# Altium project BEAR4.PrjPcb (part 1 of 2)
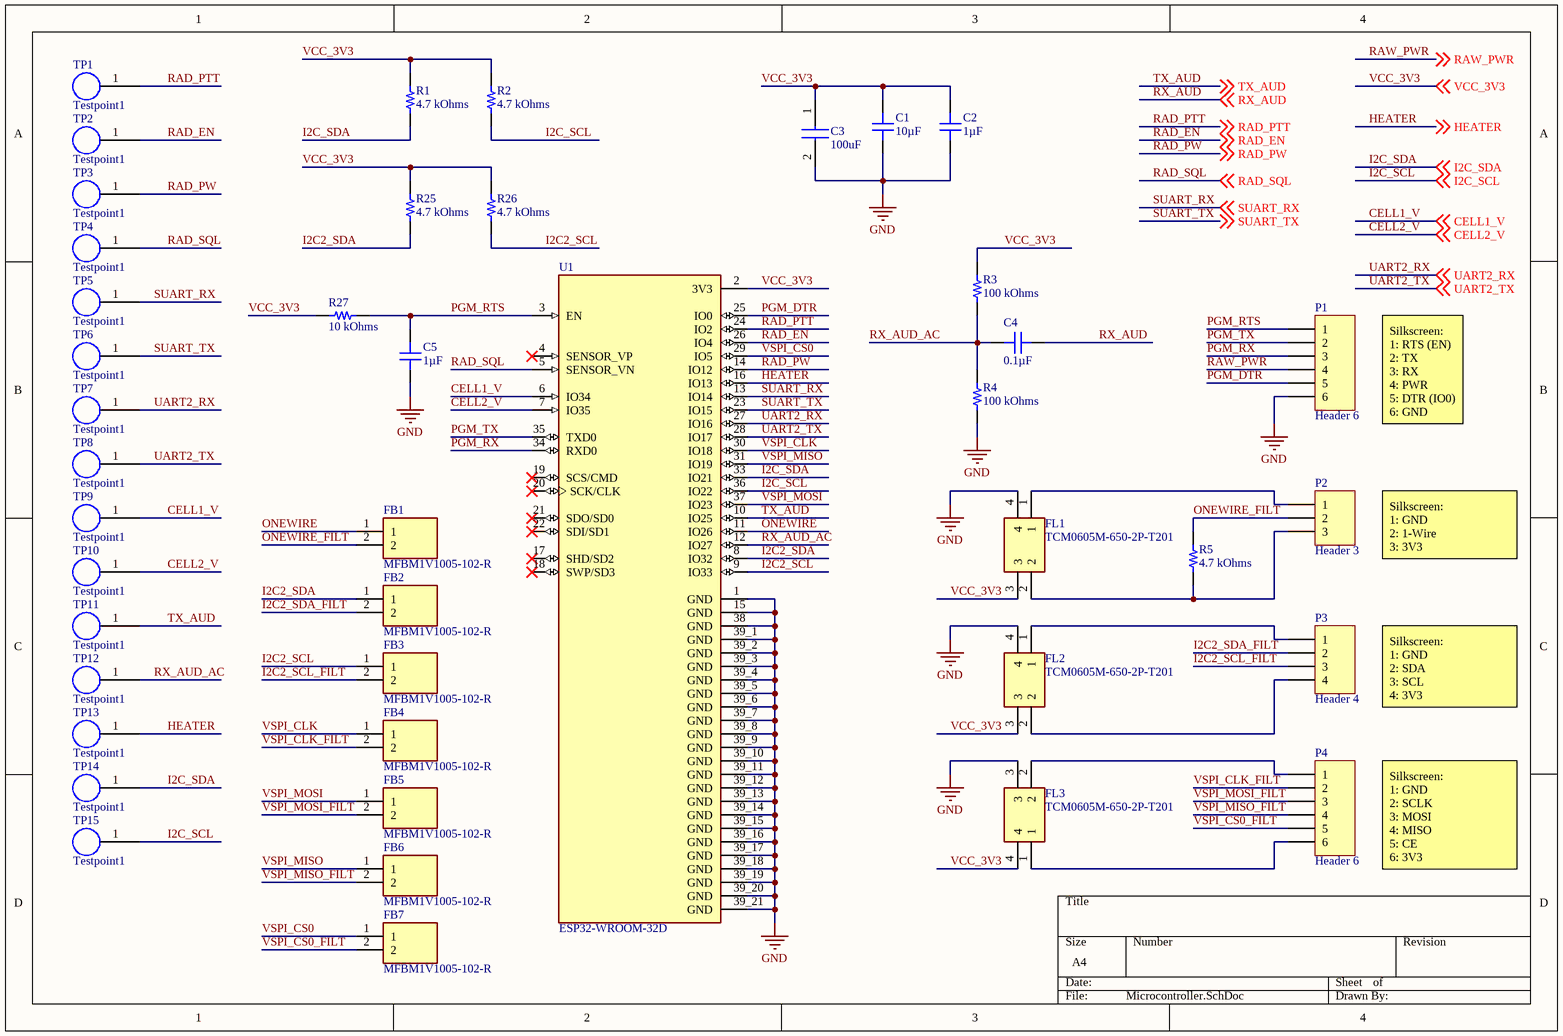
[diagram p0: Microcontroller.SchDoc]
5 sheets, 160 parts. Net scope: global (net labels, ports and power ports of the same name join across sheets).
Board files: BEAR4.PcbDoc, BEAR4_Panel.PcbDoc
Sheets:
  Microcontroller.SchDoc
  Power.SchDoc
  SensorSuite.SchDoc
  Radio.SchDoc
  GPS.SchDoc

## Sheet Microcontroller.SchDoc
size A4; SheetNumber: 1; SheetTotal: 5

### Parts
C1  10µF  [CAP 0402_1005]
C2  1µF  [CAP 0402_1005]
C3  100uF  [CAPC3225X270N]
C4  0.1µF  [CAP 0402_1005]
C5  1µF  [CAP 0402_1005]
FB1  MFBM1V1005-102-R  [BEADC1005X65N]
FB2  MFBM1V1005-102-R  [BEADC1005X65N]
FB3  MFBM1V1005-102-R  [BEADC1005X65N]
FB4  MFBM1V1005-102-R  [BEADC1005X65N]
FB5  MFBM1V1005-102-R  [BEADC1005X65N]
FB6  MFBM1V1005-102-R  [BEADC1005X65N]
FB7  MFBM1V1005-102-R  [BEADC1005X65N]
FL1  TCM0605M-650-2P-T201  [TCM0605M]
FL2  TCM0605M-650-2P-T201  [TCM0605M]
FL3  TCM0605M-650-2P-T201  [TCM0605M]
P1  Header 6  [HDR1X6]
P2  Header 3  [HDR1X3]
P3  Header 4  [HDR1X4]
P4  Header 6  [HDR1X6]
R1  4.7 kOhms  [RES 0402_1005]
R2  4.7 kOhms  [RES 0402_1005]
R3  100 kOhms  [RES 0402_1005]
R4  100 kOhms  [RES 0402_1005]
R5  4.7 kOhms  [RES 0402_1005]
R25  4.7 kOhms  [RES 0402_1005]
R26  4.7 kOhms  [RES 0402_1005]
R27  10 kOhms  [RES 0402_1005]
TP1  Testpoint1  [Testpoint1]  (no BOM)
TP2  Testpoint1  [Testpoint1]  (no BOM)
TP3  Testpoint1  [Testpoint1]  (no BOM)
TP4  Testpoint1  [Testpoint1]  (no BOM)
TP5  Testpoint1  [Testpoint1]  (no BOM)
TP6  Testpoint1  [Testpoint1]  (no BOM)
TP7  Testpoint1  [Testpoint1]  (no BOM)
TP8  Testpoint1  [Testpoint1]  (no BOM)
TP9  Testpoint1  [Testpoint1]  (no BOM)
TP10  Testpoint1  [Testpoint1]  (no BOM)
TP11  Testpoint1  [Testpoint1]  (no BOM)
TP12  Testpoint1  [Testpoint1]  (no BOM)
TP13  Testpoint1  [Testpoint1]  (no BOM)
TP14  Testpoint1  [Testpoint1]  (no BOM)
TP15  Testpoint1  [Testpoint1]  (no BOM)
U1  ESP32-WROOM-32D  [MODULE_ESP32-WROOM-32D]

### Nets
GND: C1.1 C2.1 C3.2 C5.1 FL1.4 FL2.4 FL3.3 P1.6 R4.1 U1.1(GND) U1.15(GND) U1.38(GND) U1.39_1(GND) U1.39_2(GND) U1.39_3(GND) U1.39_4(GND) U1.39_5(GND) U1.39_6(GND) U1.39_7(GND) U1.39_8(GND) U1.39_9(GND) U1.39_10(GND) U1.39_11(GND) U1.39_12(GND) U1.39_13(GND) U1.39_14(GND) U1.39_15(GND) U1.39_16(GND) U1.39_17(GND) U1.39_18(GND) U1.39_19(GND) U1.39_20(GND) U1.39_21(GND)
CELL1_V: TP9.1 U1.6(IO34) ; off-sheet CELL1_V
CELL2_V: TP10.1 U1.7(IO35) ; off-sheet CELL2_V
HEATER: TP13.1 U1.16(IO13) ; off-sheet HEATER
I2C2_SCL: FB3.1 R26.1 U1.9(IO33)
I2C2_SCL_FILT: FB3.2 P3.3
I2C2_SDA: FB2.1 R25.1 U1.8(IO32)
I2C2_SDA_FILT: FB2.2 P3.2
I2C_SCL: R2.1 TP15.1 U1.36(IO22) ; off-sheet I2C_SCL
I2C_SDA: R1.1 TP14.1 U1.33(IO21) ; off-sheet I2C_SDA
ONEWIRE: FB1.1 U1.11(IO26)
ONEWIRE_FILT: FB1.2 P2.2 R5.2
PGM_DTR: P1.5 U1.25(IO0)
PGM_RTS: C5.2 P1.1 R27.2 U1.3(EN)
PGM_RX: P1.3 U1.34(RXD0)
PGM_TX: P1.2 U1.35(TXD0)
RAD_EN: TP2.1 U1.26(IO4) ; off-sheet RAD_EN
RAD_PTT: TP1.1 U1.24(IO2) ; off-sheet RAD_PTT
RAD_PW: TP3.1 U1.14(IO12) ; off-sheet RAD_PW
RAD_SQL: TP4.1 U1.5(SENSOR_VN) ; off-sheet RAD_SQL
RAW_PWR: P1.4 ; off-sheet RAW_PWR
RX_AUD: C4.1 ; off-sheet RX_AUD
RX_AUD_AC: C4.2 R3.1 R4.2 TP12.1 U1.12(IO27)
SUART_RX: TP5.1 U1.13(IO14) ; off-sheet SUART_RX
SUART_TX: TP6.1 U1.23(IO15) ; off-sheet SUART_TX
TX_AUD: TP11.1 U1.10(IO25) ; off-sheet TX_AUD
UART2_RX: TP7.1 U1.27(IO16) ; off-sheet UART2_RX
UART2_TX: TP8.1 U1.28(IO17) ; off-sheet UART2_TX
VCC_3V3: C1.2 C2.2 C3.1 FL1.3 FL2.3 FL3.4 R1.2 R2.2 R3.2 R25.2 R26.2 R27.1 U1.2(3V3) ; off-sheet VCC_3V3
VSPI_CLK: FB4.1 U1.30(IO18)
VSPI_CLK_FILT: FB4.2 P4.2
VSPI_CS0: FB7.1 U1.29(IO5)
VSPI_CS0_FILT: FB7.2 P4.5
VSPI_MISO: FB6.1 U1.31(IO19)
VSPI_MISO_FILT: FB6.2 P4.4
VSPI_MOSI: FB5.1 U1.37(IO23)
VSPI_MOSI_FILT: FB5.2 P4.3
NetFL1_1: FL1.1 P2.1
NetFL1_2: FL1.2 P2.3 R5.1
NetFL2_1: FL2.1 P3.1
NetFL2_2: FL2.2 P3.4
NetFL3_1: FL3.1 P4.6
NetFL3_2: FL3.2 P4.1

Not connected (* = marked no-connect by the designer): U1 4(SENSOR_VP)* 17(SHD/SD2)* 18(SWP/SD3)* 19(SCS/CMD)* 20(SCK/CLK)* 21(SDO/SD0)* 22(SDI/SD1)*

### Notes on the sheet
- Silkscreen:
  1: RTS (EN)
  2: TX
  3: RX
  4: PWR
  5: DTR (IO0)
  6: GND
- Silkscreen:
  1: GND
  2: 1-Wire
  3: 3V3
- Silkscreen:
  1: GND
  2: SDA
  3: SCL
  4: 3V3
- Silkscreen:
  1: GND
  2: SCLK
  3: MOSI
  4: MISO
  5: CE
  6: 3V3

### Library data of the parts
C1 = C0402C106M9PAC7867: CAP CER 10UF 6.3V X5R 0402; Manufacturer: KEMET; Tolerance: ±20%; Part Number: C0402C106M9PAC7867; Value: 10µF; Applications: General Purpose; Capacitance: 10µF; ComponentLink1Description: Datasheet; ComponentLink1URL: https://api.kemet.com/component-edge/download/datasheet/C0402C106M9PAC7867.pdf; ComponentLink2Description: DigiKey Link; ComponentLink2URL: http://digikey.com/product-detail/en/kemet/C0402C106M9PAC7867/399-13069-1-ND/5767556; Device Package: 0402 (1005 Metric); LastUpdated: 2/9/2020 1:02:21 AM; Lifecycle Status: Active; Minimum Order: 1; Mounting Type: Surface Mount, MLCC; Operating Temperature: -55°C ~ 85°C; Package / Case: 0402 (1005 Metric); Packaging: TapeAndReel; PartId: 3087; Part Status: Active; Price: 0.13; Series: SMD Comm X5R; Size / Dimension: 0.039" L x 0.020" W (1.00mm x 0.50mm); Supplier 1: DigiKey; Supplier Part Number 1: 399-13069-1-ND; Temperature Coefficient: X5R; Thickness (Max): 0.028" (0.70mm); Voltage - Rated: 6.3V
C2 C5 = 0402YD105KAT2A: CAP CER 1UF 16V X5R 0402; Manufacturer: AVX Corporation; Tolerance: ±10%; Part Number: 0402YD105KAT2A; Value: 1µF; Applications: General Purpose; Capacitance: 1µF; ComponentLink1Description: Datasheet; ComponentLink1URL: http://datasheets.avx.com/cx5r.pdf; ComponentLink2Description: DigiKey Link; ComponentLink2URL: http://digikey.com/product-detail/en/avx-corporation/0402YD105KAT2A/478-10179-1-ND/6797606; Device Package: 0402 (1005 Metric); LastUpdated: 2/9/2020 1:02:22 AM; Lifecycle Status: Active; Minimum Order: 1; Mounting Type: Surface Mount, MLCC; Operating Temperature: -55°C ~ 85°C; Package / Case: 0402 (1005 Metric); Packaging: TapeAndReel; PartId: 2859; Part Status: Active; Price: 0.07; Series: -; Size / Dimension: 0.039" L x 0.020" W (1.00mm x 0.50mm); Supplier 1: DigiKey; Supplier Part Number 1: 478-10179-1-ND; Temperature Coefficient: X5R; Thickness (Max): 0.022" (0.55mm); Voltage - Rated: 16V
C3 = GRM32EC70J107ME15L: Capacitor; Manufacturer_Name: Murata Electronics; Datasheet Link: https://componentsearchengine.com//GRM32EC70J107ME15L.pdf; Height: 2.7mm; Mouser2 Part Number: 81-GRM32EC70J107ME5L; Mouser2 Price/Stock: https://www.mouser.com/Search/Refine.aspx?Keyword=81-GRM32EC70J107ME5L; Manufacturer_Part_Number: GRM32EC70J107ME15L
C4 = C0402C104K9PACTU: CAP CER 0.1UF 6.3V X5R 0402; Manufacturer: KEMET; Tolerance: ±10%; Part Number: C0402C104K9PACTU; Value: 0.1µF; Applications: General Purpose; Capacitance: 0.1µF; ComponentLink1Description: Datasheet; ComponentLink1URL: https://api.kemet.com/component-edge/download/datasheet/C0402C104K9PACTU.pdf; ComponentLink2Description: DigiKey Link; ComponentLink2URL: http://digikey.com/product-detail/en/kemet/C0402C104K9PACTU/399-3026-1-ND/447602; Device Package: 0402 (1005 Metric); LastUpdated: 2/9/2020 1:01:34 AM; Lifecycle Status: Active; Minimum Order: 1; Mounting Type: Surface Mount, MLCC; Operating Temperature: -55°C ~ 85°C; Package / Case: 0402 (1005 Metric); Packaging: TapeAndReel; PartId: 12742; Part Status: Active; Price: 0.01; Series: SMD Comm X5R; Size / Dimension: 0.039" L x 0.020" W (1.00mm x 0.50mm); Supplier 1: DigiKey; Supplier Part Number 1: 399-3026-1-ND; Temperature Coefficient: X5R; Thickness (Max): 0.022" (0.55mm); Voltage - Rated: 6.3V
FB1-FB7 = MFBM1V1005-102-R: Ferrite Bead; Manufacturer_Name: Eaton; Manufacturer_Part_Number: MFBM1V1005-101-R; Assembly Instruction: DNP; Datasheet Link: https://www.mouser.in/datasheet/2/87/eaton_mfbm1v1005_high_current_multilayer_ferrite_c-1890673.pdf; Height: 0.65mm
FL1-FL3 = TCM0605M-650-2P-T201: Filter; Manufacturer_Name: TDK; Assembly Instruction: DNP; Datasheet Link: https://product.tdk.com/system/files/dam/doc/product/emc/emc/cmf_cmc/catalog/cmf_commercial_signal_tcm0605m_en.pdf; Height: 0.35mm; Manufacturer_Part_Number: TCM0605M-650-2P-T201
P1 P4 = Header 6: Header, 6-Pin; LatestRevisionDate: 17-Jul-2002; LatestRevisionNote: Re-released for DXP Platform.; Publisher: Altium Limited
P2 = Header 3: Header, 3-Pin; LatestRevisionDate: 17-Jul-2002; LatestRevisionNote: Re-released for DXP Platform.; Publisher: Altium Limited
P3 = Header 4: Header, 4-Pin; LatestRevisionDate: 17-Jul-2002; LatestRevisionNote: Re-released for DXP Platform.; Publisher: Altium Limited
R1 R2 R25 R26 = CRCW04024K70JNEDC: RES SMD 4.7K OHM 5% 1/16W 0402; Manufacturer: Vishay Dale; Power (Watts): 0.063W, 1/16W; Temperature Coefficient: ±200ppm/°C; Part Number: CRCW04024K70JNEDC; Value: 4.7 kOhms; ComponentLink1Description: Datasheet; ComponentLink1URL: http://www.vishay.com/docs/28773/crcwce3.pdf; ComponentLink2Description: DigiKey Link; ComponentLink2URL: http://digikey.com/product-detail/en/vishay-dale/CRCW04024K70JNEDC/541-3974-1-ND/7928657; Composition: Thick Film; Device Package: 0402 (1005 Metric); Height - Seated (Max): 0.014" (0.35mm); LastUpdated: 2/9/2020 1:07:41 AM; Lifecycle Status: Active; Minimum Order: 1; Number of Terminations: 2; Operating Temperature: -55°C ~ 155°C; Package / Case: 0402 (1005 Metric); Packaging: CutTape; PartId: 15960; Part Status: Active; Price: 0.10; Resistance: 4.7 kOhms; Series: CRCW-C; Size / Dimension: 0.039" L x 0.020" W (1.00mm x 0.50mm); Supplier 1: DigiKey; Supplier Part Number 1: 541-3974-1-ND; Supplier Device Package: 0402; Tolerance: ±5%
R3 R4 = AC0402FR-07100KL: RES SMD 100K OHM 1% 1/16W 0402; Manufacturer: Yageo; Power (Watts): 0.063W, 1/16W; Temperature Coefficient: ±100ppm/°C; Part Number: AC0402FR-07100KL; Value: 100 kOhms; ComponentLink1Description: Datasheet; ComponentLink1URL: https://www.yageo.com/upload/media/product/productsearch/datasheet/rchip/PYu-AC_51_RoHS_L_7.pdf; ComponentLink2Description: DigiKey Link; ComponentLink2URL: http://digikey.com/product-detail/en/yageo/AC0402FR-07100KL/YAG3434CT-ND/6006283; Composition: Thick Film; Device Package: 0402 (1005 Metric); Features: Automotive AEC-Q200, Moisture Resistant; Height - Seated (Max): 0.015" (0.37mm); LastUpdated: 2/9/2020 1:07:50 AM; Lifecycle Status: Active; Minimum Order: 1; Number of Terminations: 2; Operating Temperature: -55°C ~ 155°C; Package / Case: 0402 (1005 Metric); Packaging: CutTape; PartId: 12047; Part Status: Active; Price: 0.10; Ratings: AEC-Q200; Resistance: 100 kOhms; Series: AC; Size / Dimension: 0.039" L x 0.020" W (1.00mm x 0.50mm); Supplier 1: DigiKey; Supplier Part Number 1: YAG3434CT-ND; Supplier Device Package: 0402; Tolerance: ±1%
R5 = CRCW04024K70JNEDC: RES SMD 4.7K OHM 5% 1/16W 0402; Manufacturer: Vishay Dale; Power (Watts): 0.063W, 1/16W; Temperature Coefficient: ±200ppm/°C; Assembly Instruction: DNP; Part Number: CRCW04024K70JNEDC; Value: 4.7 kOhms; ComponentLink1Description: Datasheet; ComponentLink1URL: http://www.vishay.com/docs/28773/crcwce3.pdf; ComponentLink2Description: DigiKey Link; ComponentLink2URL: http://digikey.com/product-detail/en/vishay-dale/CRCW04024K70JNEDC/541-3974-1-ND/7928657; Composition: Thick Film; Device Package: 0402 (1005 Metric); Height - Seated (Max): 0.014" (0.35mm); LastUpdated: 2/9/2020 1:07:41 AM; Lifecycle Status: Active; Minimum Order: 1; Number of Terminations: 2; Operating Temperature: -55°C ~ 155°C; Package / Case: 0402 (1005 Metric); Packaging: CutTape; PartId: 15960; Part Status: Active; Price: 0.10; Resistance: 4.7 kOhms; Series: CRCW-C; Size / Dimension: 0.039" L x 0.020" W (1.00mm x 0.50mm); Supplier 1: DigiKey; Supplier Part Number 1: 541-3974-1-ND; Supplier Device Package: 0402; Tolerance: ±5%
R27 = CPF0402B10KE1: RES SMD 10K OHM 0.1% 1/16W 0402; Manufacturer: TE Connectivity Passive Product; Power (Watts): 0.063W, 1/16W; Temperature Coefficient: ±25ppm/°C; Part Number: CPF0402B10KE1; Value: 10 kOhms; ComponentLink1Description: Datasheet; ComponentLink1URL: https://www.te.com/commerce/DocumentDelivery/DDEController?Action=srchrtrv&DocNm=1773200&DocType=DS&DocLang=English; ComponentLink2Description: DigiKey Link; ComponentLink2URL: http://digikey.com/product-detail/en/te-connectivity-passive-product/CPF0402B10KE1/A102579CT-ND/2729112; Composition: Thin Film; Device Package: 0402 (1005 Metric); Height - Seated (Max): 0.014" (0.35mm); LastUpdated: 2/9/2020 1:07:41 AM; Lifecycle Status: Active; Minimum Order: 1; Number of Terminations: 2; Operating Temperature: -55°C ~ 155°C; Package / Case: 0402 (1005 Metric); Packaging: TapeAndReel; PartId: 15889; Part Status: Active; Price: 0.13; Resistance: 10 kOhms; Series: CPF, Neohm; Size / Dimension: 0.039" L x 0.020" W (1.00mm x 0.50mm); Supplier 1: DigiKey; Supplier Part Number 1: A102579CT-ND; Supplier Device Package: 0402; Tolerance: ±0.1%
U1 = ESP32-WROOM-32D: Bluetooth, WiFi 802.11b/g/n, Bluetooth v4.2 + EDR, Class 1, 2 and 3 Transceiver Module 2.4GHz ~ 2.5GHz Integrated, Trace Surface Mount; MF: Espressif Systems; Price: None; Package: Module Espressif Systems; Availability: Unavailable; SnapEDA_Link: https://www.snapeda.com/parts/ESP32-WROOM-32D/Espressif%20Systems/view-part/2768115/?ref=snap; Value: *; MP: ESP32-WROOM-32D

## Sheet Power.SchDoc
size A4; SheetNumber: 2; SheetTotal: 5
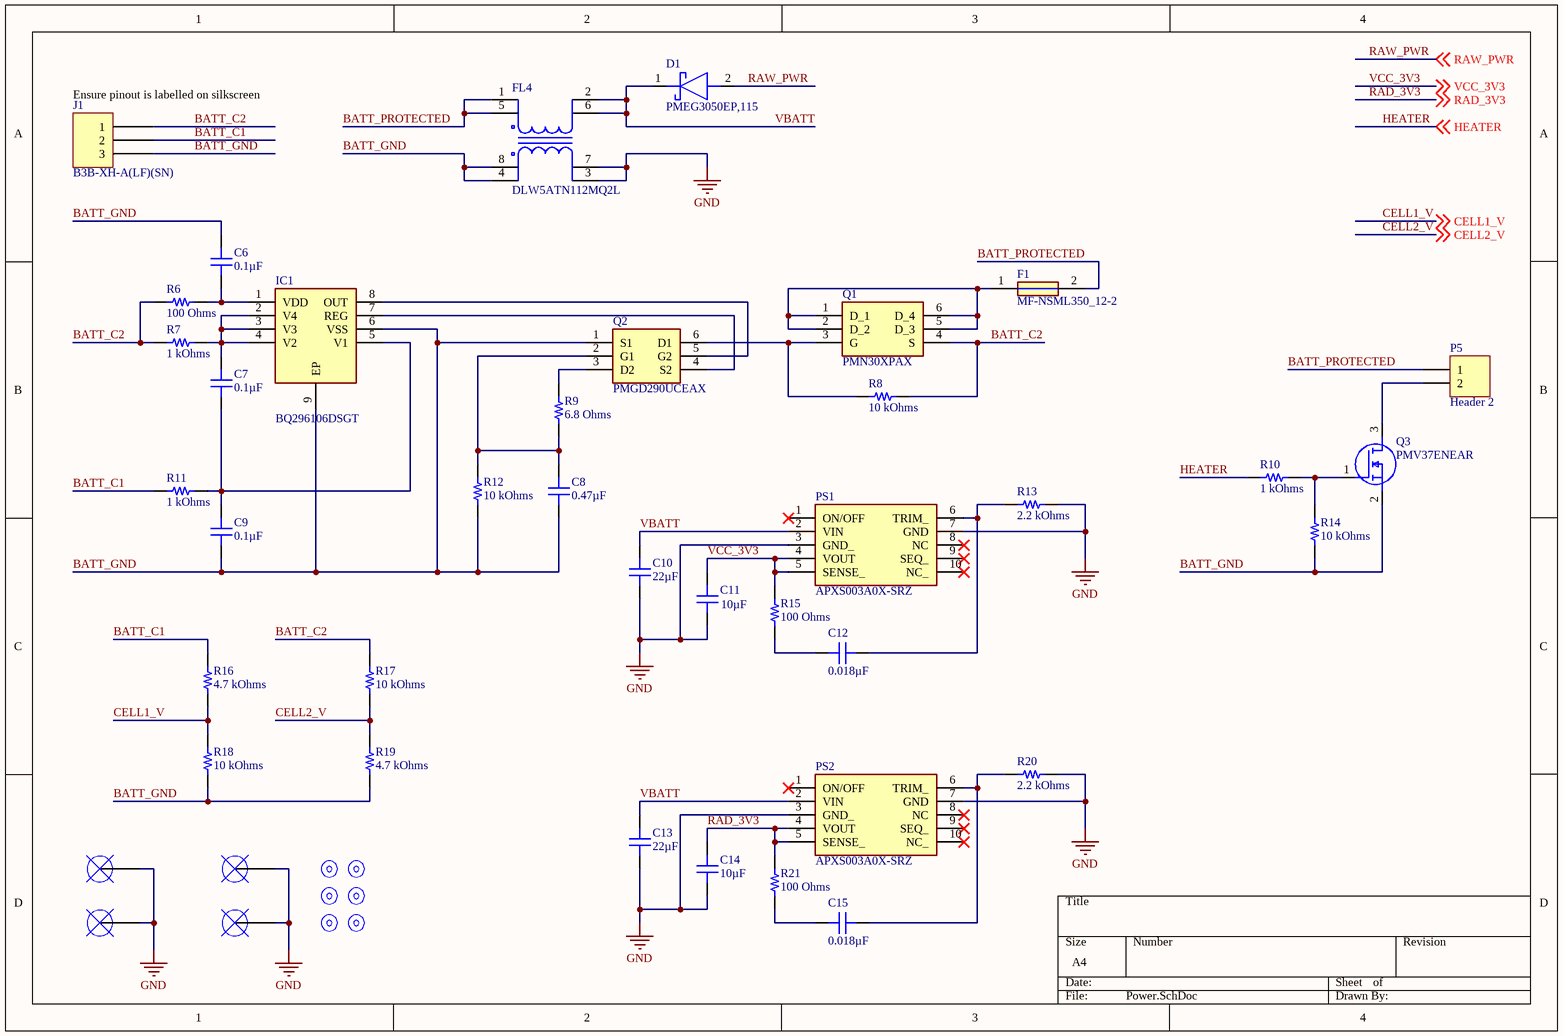
[diagram p1: Power.SchDoc]

### Parts
C6  0.1µF  [CAP 0402_1005]
C7  0.1µF  [CAP 0402_1005]
C8  0.47µF  [CAP 0402_1005]
C9  0.1µF  [CAP 0402_1005]
C10  22µF  [CAP 0805_2012]
C11  10µF  [CAP 0402_1005]
C12  0.018µF  [CAP 0402_1005]
C13  22µF  [CAP 0805_2012]
C14  10µF  [CAP 0402_1005]
C15  0.018µF  [CAP 0402_1005]
D1  PMEG3050EP,115  [PMEG3050EP115]
F1  MF-NSML350_12-2  [FUSC3216X140N]
FL4  DLW5ATN112MQ2L  [DLW5BSN302SQ2L]
FM1  1mm  [FIDUCIAL_MARK_ROUND]  (value not drawn)  (no BOM)
FM2  1mm  [FIDUCIAL_MARK_ROUND]  (value not drawn)  (no BOM)
FM3  1mm  [FIDUCIAL_MARK_ROUND]  (value not drawn)  (no BOM)
FM4  1mm  [FIDUCIAL_MARK_ROUND]  (value not drawn)  (no BOM)
FM5  1mm  [FIDUCIAL_MARK_ROUND]  (value not drawn)  (no BOM)
FM6  1mm  [FIDUCIAL_MARK_ROUND]  (value not drawn)  (no BOM)
IC1  BQ296106DSGT  [SON50P200X200X80-9N]
J1  B3B-XH-A(LF)(SN)  [JST XH B3B-XH-A]
MH1  2.7mm  [Mounting_Hole_Plated_2.7mm-COVERED]  (value not drawn)  (no BOM)
MH2  2.7mm  [Mounting_Hole_Plated_2.7mm-COVERED]  (value not drawn)  (no BOM)
MH3  2.7mm  [Mounting_Hole_Plated_2.7mm-COVERED]  (value not drawn)  (no BOM)
MH4  2.7mm  [Mounting_Hole_Plated_2.7mm-COVERED]  (value not drawn)  (no BOM)
P5  Header 2  [HDR1X2]
PS1  APXS003A0X-SRZ  [APTH003A0XSRZ]
PS2  APXS003A0X-SRZ  [APTH003A0XSRZ]
Q1  PMN30XPAX  [SOT95P275X110-6N]
Q2  PMGD290UCEAX  [SOT65P210X110-6N]
Q3  PMV37ENEAR  [SOT95P230X110-3N]
R6  100 Ohms  [RES 0402_1005]
R7  1 kOhms  [RES 0402_1005]
R8  10 kOhms  [RES 0402_1005]
R9  6.8 Ohms  [RES 0402_1005]
R10  1 kOhms  [RES 0402_1005]
R11  1 kOhms  [RES 0402_1005]
R12  10 kOhms  [RES 0402_1005]
R13  2.2 kOhms  [RES 0402_1005]
R14  10 kOhms  [RES 0402_1005]
R15  100 Ohms  [RES 0402_1005]
R16  4.7 kOhms  [RES 0402_1005]
R17  10 kOhms  [RES 0402_1005]
R18  10 kOhms  [RES 0402_1005]
R19  4.7 kOhms  [RES 0402_1005]
R20  2.2 kOhms  [RES 0402_1005]
R21  100 Ohms  [RES 0402_1005]

### Nets
GND: C10.1 C11.1 C13.1 C14.1 FL4.3 FL4.7 MH1.0 MH2.0 MH3.0 MH4.0 PS1.3(GND_) PS1.7(GND) PS2.3(GND_) PS2.7(GND) R13.1 R20.2
BATT_C1: J1.2 R11.1 R16.2
BATT_C2: J1.1 Q1.4(S) R6.2 R7.1 R8.1 R17.1
BATT_GND: C6.2 C8.1 C9.1 FL4.4 FL4.8 IC1.6(VSS) IC1.9(EP) J1.3 Q2.1(S1) Q3.2(S) R12.2 R14.2 R18.2 R19.1
BATT_PROTECTED: F1.2 FL4.1 FL4.5 P5.1
CELL1_V: R16.1 R18.1 ; off-sheet CELL1_V
CELL2_V: R17.2 R19.2 ; off-sheet CELL2_V
HEATER: R10.1 ; off-sheet HEATER
RAD_3V3: C14.2 PS2.4(VOUT) PS2.5(SENSE_) R21.1 ; off-sheet RAD_3V3
RAW_PWR: D1.2(A) ; off-sheet RAW_PWR
VBATT: C10.2 C13.2 D1.1(K) FL4.2 FL4.6 PS1.2(VIN) PS2.2(VIN)
VCC_3V3: C11.2 PS1.4(VOUT) PS1.5(SENSE_) R15.1 ; off-sheet VCC_3V3
NetC6_1: C6.1 IC1.1(VDD) R6.1
NetC7_1: C7.1 C9.2 IC1.5(V1) R11.2
NetC7_2: C7.2 IC1.2(V4) IC1.3(V3) IC1.4(V2) R7.2
NetC8_2: C8.2 Q2.2(G1) R9.1 R12.1
NetC12_1: C12.1 R15.2
NetC12_2: C12.2 PS1.6(TRIM_) R13.2
NetC15_1: C15.1 R21.2
NetC15_2: C15.2 PS2.6(TRIM_) R20.1
NetF1_1: F1.1 Q1.1(D_1) Q1.2(D_2) Q1.5(D_3) Q1.6(D_4)
NetIC1_7: IC1.7(REG) Q2.4(S2)
NetIC1_8: IC1.8(OUT) Q2.5(G2)
NetP5_2: P5.2 Q3.3(D)
NetQ1_3: Q1.3(G) Q2.6(D1) R8.2
NetQ2_3: Q2.3(D2) R9.2
NetQ3_1: Q3.1(G) R10.2 R14.1

Not connected (* = marked no-connect by the designer): FM1 FD0; FM2 FD0; FM3 FD0; FM4 FD0; FM5 FD0; FM6 FD0; PS1 1(ON/OFF)* 8(NC)* 9(SEQ_)* 10(NC_)*; PS2 1(ON/OFF)* 8(NC)* 9(SEQ_)* 10(NC_)*

### Notes on the sheet
- (near J1) Ensure pinout is labelled on silkscreen

### Library data of the parts
C6 C7 C9 = C0402C104K9PACTU: as C4 on sheet Microcontroller; Part Number: C0402C104K9PACTU; Value: 0.1µF; Applications: General Purpose; Capacitance: 0.1µF; ComponentLink1Description: Datasheet; ComponentLink1URL: https://api.kemet.com/component-edge/download/datasheet/C0402C104K9PACTU.pdf; ComponentLink2Description: DigiKey Link; ComponentLink2URL: http://digikey.com/product-detail/en/kemet/C0402C104K9PACTU/399-3026-1-ND/447602; Device Package: 0402 (1005 Metric); LastUpdated: 2/9/2020 1:01:34 AM; Lifecycle Status: Active; Minimum Order: 1; Mounting Type: Surface Mount, MLCC; Operating Temperature: -55°C ~ 85°C; Package / Case: 0402 (1005 Metric); Packaging: TapeAndReel; PartId: 12742; Part Status: Active; Price: 0.01; Series: SMD Comm X5R; Size / Dimension: 0.039" L x 0.020" W (1.00mm x 0.50mm); Supplier 1: DigiKey; Supplier Part Number 1: 399-3026-1-ND; Temperature Coefficient: X5R; Thickness (Max): 0.022" (0.55mm); Voltage - Rated: 6.3V
C8 = C1005X5R1E474K050BE: CAP CER 0.47UF 25V X5R 0402; Manufacturer: TDK Corporation; Tolerance: ±10%; Part Number: C1005X5R1E474K050BE; Value: 0.47µF; Applications: Boardflex Sensitive; Capacitance: 0.47µF; ComponentLink1Description: Datasheet; ComponentLink1URL: https://product.tdk.com/info/en/catalog/datasheets/mlcc_commercial_soft_en.pdf?ref_disty=digikey; ComponentLink2Description: DigiKey Link; ComponentLink2URL: http://digikey.com/product-detail/en/tdk-corporation/C1005X5R1E474K050BE/445-175217-1-ND/7907781; Device Package: 0402 (1005 Metric); Features: Soft Termination; LastUpdated: 2/9/2020 1:01:22 AM; Lifecycle Status: Active; Minimum Order: 1; Mounting Type: Surface Mount, MLCC; Operating Temperature: -55°C ~ 85°C; Package / Case: 0402 (1005 Metric); Packaging: TapeAndReel; PartId: 13175; Part Status: Active; Price: 0.02; Series: C; Size / Dimension: 0.039" L x 0.020" W (1.00mm x 0.50mm); Supplier 1: DigiKey; Supplier Part Number 1: 445-175217-1-ND; Temperature Coefficient: X5R; Thickness (Max): 0.024" (0.60mm); Voltage - Rated: 25V
C10 C13 = C2012X6S1C226M125AC: CAP CER 22UF 16V X6S 0805; Manufacturer: TDK Corporation; Tolerance: ±20%; Part Number: C2012X6S1C226M125AC; Value: 22µF; Applications: General Purpose; Capacitance: 22µF; ComponentLink1Description: Datasheet; ComponentLink1URL: https://product.tdk.com/info/en/catalog/datasheets/mlcc_commercial_general_en.pdf?ref_disty=digikey; ComponentLink2Description: DigiKey Link; ComponentLink2URL: http://digikey.com/product-detail/en/tdk-corporation/C2012X6S1C226M125AC/445-14486-1-ND/3956152; Device Package: 0805 (2012 Metric); Features: Low ESL; LastUpdated: 2/9/2020 1:04:25 AM; Lifecycle Status: Active; Minimum Order: 1; Mounting Type: Surface Mount, MLCC; Operating Temperature: -55°C ~ 105°C; Package / Case: 0805 (2012 Metric); Packaging: TapeAndReel; PartId: 11672; Part Status: Active; Price: 0.19; Series: C; Size / Dimension: 0.079" L x 0.049" W (2.00mm x 1.25mm); Supplier 1: DigiKey; Supplier Part Number 1: 445-14486-1-ND; Temperature Coefficient: X6S; Thickness (Max): 0.057" (1.45mm); Voltage - Rated: 16V
C11 C14 = C0402C106M9PAC7867: as C1 on sheet Microcontroller; Part Number: C0402C106M9PAC7867; Value: 10µF; Applications: General Purpose; Capacitance: 10µF; ComponentLink1Description: Datasheet; ComponentLink1URL: https://api.kemet.com/component-edge/download/datasheet/C0402C106M9PAC7867.pdf; ComponentLink2Description: DigiKey Link; ComponentLink2URL: http://digikey.com/product-detail/en/kemet/C0402C106M9PAC7867/399-13069-1-ND/5767556; Device Package: 0402 (1005 Metric); LastUpdated: 2/9/2020 1:02:21 AM; Lifecycle Status: Active; Minimum Order: 1; Mounting Type: Surface Mount, MLCC; Operating Temperature: -55°C ~ 85°C; Package / Case: 0402 (1005 Metric); Packaging: TapeAndReel; PartId: 3087; Part Status: Active; Price: 0.13; Series: SMD Comm X5R; Size / Dimension: 0.039" L x 0.020" W (1.00mm x 0.50mm); Supplier 1: DigiKey; Supplier Part Number 1: 399-13069-1-ND; Temperature Coefficient: X5R; Thickness (Max): 0.028" (0.70mm); Voltage - Rated: 6.3V
C12 C15 = CC0402KRX7R8BB183: CAP CER 0.018UF 25V X7R 0402; Manufacturer: Yageo; Tolerance: ±10%; Part Number: CC0402KRX7R8BB183; Value: 0.018µF; Applications: General Purpose; Capacitance: 0.018µF; ComponentLink1Description: Datasheet; ComponentLink1URL: https://www.yageo.com/upload/media/product/productsearch/datasheet/mlcc/UPY-GPHC_X7R_6.3V-to-50V_18.pdf; ComponentLink2Description: DigiKey Link; ComponentLink2URL: http://digikey.com/product-detail/en/yageo/CC0402KRX7R8BB183/311-3345-1-ND/6818315; Device Package: 0402 (1005 Metric); LastUpdated: 2/9/2020 1:02:03 AM; Lifecycle Status: Active; Minimum Order: 1; Mounting Type: Surface Mount, MLCC; Operating Temperature: -55°C ~ 125°C; Package / Case: 0402 (1005 Metric); Packaging: TapeAndReel; PartId: 11317; Part Status: Active; Price: 0.01; Series: CC; Size / Dimension: 0.039" L x 0.020" W (1.00mm x 0.50mm); Supplier 1: DigiKey; Supplier Part Number 1: 311-3345-1-ND; Temperature Coefficient: X7R; Thickness (Max): 0.022" (0.55mm); Voltage - Rated: 25V
D1 = PMEG3050EP,115: Schottky Diode; Manufacturer_Name: Nexperia; Datasheet Link: https://datasheet.datasheetarchive.com/originals/distributors/Datasheets_SAMA/fa882cf4aa6eed6383790f96e9182165.pdf; Height: 1mm; Manufacturer_Part_Number: PMEG3050EP,115
F1 = MF-NSML350_12-2: Fuse; Manufacturer_Name: Bourns; Manufacturer_Part_Number: MF-NSML350/12-2; Datasheet Link: https://componentsearchengine.com/Datasheets/1/MF-NSML350_12-2.pdf; Height: 1.4mm
FL4 = DLW5ATN112MQ2L: Filter; Manufacturer_Name: Murata Electronics; Datasheet Link: https://componentsearchengine.com//DLW5ATN112MQ2L.pdf; Height: 2.35mm; Mouser2 Part Number: 81-DLW5ATN112MQ2L; Mouser2 Price/Stock: https://www.mouser.com/Search/Refine.aspx?Keyword=81-DLW5ATN112MQ2L; Manufacturer_Part_Number: DLW5ATN112MQ2L
FM1-FM6 = Fiducial_Mark: Fiducial mark, width 1mm, clearance 3mm; Width: 1 mm; Clearance: 3 mm
IC1 = BQ296106DSGT: Integrated Circuit; Manufacturer_Name: Texas Instruments; Datasheet Link: https://www.ti.com/lit/ds/symlink/bq2961.pdf?ts=1629467003310&ref_url=https%253A%252F%252Fwww.ti.com%252Fstore%252Fti%252Fen%252Fp%252Fproduct%252F%253Fp%253DBQ296106DSGT; Height: 0.8mm; Manufacturer_Part_Number: BQ296106DSGT
J1 = B3B-XH-A(LF)(SN): CONN HEADER VERT 3POS 2.5MM; Manufacturer: JST Sales America Inc.; Contact Length - Post: 0.134" (3.40mm); Current Rating (Amps): 3A; Material Flammability Rating: UL94 V-0; Number of Positions: 3; Number of Positions Loaded: All; Pitch - Mating: 0.098" (2.50mm); Shrouding: Shrouded - 4 Wall; Style: Board to Cable/Wire; Voltage Rating: 250V; Part Number: B3B-XH-A(LF)(SN); ComponentLink1Description: Datasheet; ComponentLink1URL: http://www.jst-mfg.com/product/pdf/eng/eXH.pdf; ComponentLink2Description: DigiKey Link; ComponentLink2URL: http://digikey.com/product-detail/en/jst-sales-america-inc/B3B-XH-A-LF-SN/455-2248-ND/1651046; Connector Type: Header; Contact Finish - Mating: Tin; Contact Finish - Post: Tin; Contact Material: Brass; Contact Shape: Square; Contact Type: Male Pin; Fastening Type: Detent Lock; Insulation Color: Natural; Insulation Height: 0.276" (7.00mm); Insulation Material: Polyamide (PA66), Nylon 6/6; LastUpdated: 12/1/2020 11:46:22 PM; Lifecycle Status: Active; Minimum Order: 1; Mounting Type: Through Hole; Number of Rows: 1; Operating Temperature: -25°C ~ 85°C; Packaging: Bulk; PartId: 68; Part Status: Active; Price: 0.19; Series: XH; Supplier 1: DigiKey; Supplier Part Number 1: 455-2248-ND; Termination: Press-Fit, Solder
MH1-MH4 = Mounting_Hole_2.7mm: Mounting hole, hole size 2.7mm; Hole radius: 2.7 mm; Diameter (plated): *; Keep out (radius): *; Plated: *
P5 = Header 2: Header, 2-Pin; LatestRevisionDate: 17-Jul-2002; LatestRevisionNote: Re-released for DXP Platform.; Publisher: Altium Limited
PS1 PS2 = APXS003A0X-SRZ: Power Supply; Manufacturer_Name: ABB; Datasheet Link: https://www.mouser.sg/datasheet/2/167/APTS003A0X-1920083.pdf; Height: 6.25mm; Manufacturer_Part_Number: APXS003A0X-SRZ
Q1 = PMN30XPAX: MOSFET (P-Channel); Manufacturer_Name: Nexperia; Datasheet Link: https://www.mouser.in/datasheet/2/916/PMN30XPA-1839888.pdf; Height: 1.1mm; Manufacturer_Part_Number: PMN30XPAX
Q2 = PMGD290UCEAX: Transistor; Manufacturer_Name: Nexperia; Datasheet Link: https://ms.componentsearchengine.com/Datasheets/2/PMGD290UCEAX.pdf; Height: 1.1mm; Manufacturer_Part_Number: PMGD290UCEAX
Q3 = PMV37ENEAR: MOSFET (N-Channel); Manufacturer_Name: Nexperia; Datasheet Link: https://componentsearchengine.com/Datasheets/2/PMV37ENEAR.pdf; Height: 1.1mm; Manufacturer_Part_Number: PMV37ENEAR
R6 R15 R21 = CRG0402F100R: RES SMD 100 OHM 1% 1/16W 0402; Manufacturer: TE Connectivity Passive Product; Power (Watts): 0.063W, 1/16W; Temperature Coefficient: ±100ppm/°C; Part Number: CRG0402F100R; Value: 100 Ohms; ComponentLink1Description: Datasheet; ComponentLink1URL: https://www.te.com/commerce/DocumentDelivery/DDEController?Action=srchrtrv&DocNm=1773204&DocType=DS&DocLang=English; ComponentLink2Description: DigiKey Link; ComponentLink2URL: http://digikey.com/product-detail/en/te-connectivity-passive-product/CRG0402F100R/A121527CT-ND/5246516; Composition: Thick Film; Device Package: 0402 (1005 Metric); Height - Seated (Max): 0.016" (0.40mm); LastUpdated: 2/9/2020 1:07:28 AM; Lifecycle Status: Active; Minimum Order: 1; Number of Terminations: 2; Operating Temperature: -55°C ~ 155°C; Package / Case: 0402 (1005 Metric); Packaging: CutTape; PartId: 20718; Part Status: Active; Price: 0.10; Resistance: 100 Ohms; Series: CRG, Neohm; Size / Dimension: 0.039" L x 0.020" W (1.00mm x 0.50mm); Supplier 1: DigiKey; Supplier Part Number 1: A121527CT-ND; Supplier Device Package: 0402; Tolerance: ±1%
R7 R10 R11 = CRCW04021K00FKEDC: RES SMD 1K OHM 1% 1/16W 0402; Manufacturer: Vishay Dale; Power (Watts): 0.063W, 1/16W; Temperature Coefficient: ±100ppm/°C; Part Number: CRCW04021K00FKEDC; Value: 1 kOhms; ComponentLink1Description: Datasheet; ComponentLink1URL: http://www.vishay.com/docs/28773/crcwce3.pdf; ComponentLink2Description: DigiKey Link; ComponentLink2URL: http://digikey.com/product-detail/en/vishay-dale/CRCW04021K00FKEDC/541-3961-1-ND/7928644; Composition: Thick Film; Device Package: 0402 (1005 Metric); Height - Seated (Max): 0.014" (0.35mm); LastUpdated: 2/9/2020 1:07:49 AM; Lifecycle Status: Active; Minimum Order: 1; Number of Terminations: 2; Operating Temperature: -55°C ~ 155°C; Package / Case: 0402 (1005 Metric); Packaging: CutTape; PartId: 12669; Part Status: Active; Price: 0.10; Resistance: 1 kOhms; Series: CRCW-C; Size / Dimension: 0.039" L x 0.020" W (1.00mm x 0.50mm); Supplier 1: DigiKey; Supplier Part Number 1: 541-3961-1-ND; Supplier Device Package: 0402; Tolerance: ±1%
R8 R12 R14 R17 R18 = CPF0402B10KE1: as R27 on sheet Microcontroller; Part Number: CPF0402B10KE1; Value: 10 kOhms; ComponentLink1Description: Datasheet; ComponentLink1URL: https://www.te.com/commerce/DocumentDelivery/DDEController?Action=srchrtrv&DocNm=1773200&DocType=DS&DocLang=English; ComponentLink2Description: DigiKey Link; ComponentLink2URL: http://digikey.com/product-detail/en/te-connectivity-passive-product/CPF0402B10KE1/A102579CT-ND/2729112; Composition: Thin Film; Device Package: 0402 (1005 Metric); Height - Seated (Max): 0.014" (0.35mm); LastUpdated: 2/9/2020 1:07:41 AM; Lifecycle Status: Active; Minimum Order: 1; Number of Terminations: 2; Operating Temperature: -55°C ~ 155°C; Package / Case: 0402 (1005 Metric); Packaging: TapeAndReel; PartId: 15889; Part Status: Active; Price: 0.13; Resistance: 10 kOhms; Series: CPF, Neohm; Size / Dimension: 0.039" L x 0.020" W (1.00mm x 0.50mm); Supplier 1: DigiKey; Supplier Part Number 1: A102579CT-ND; Supplier Device Package: 0402; Tolerance: ±0.1%
R9 = ERJ-2GEJ6R8X: RES SMD 6.8 OHM 5% 1/10W 0402; Manufacturer: Panasonic Electronic Components; Power (Watts): 0.1W, 1/10W; Temperature Coefficient: -100/ +600ppm/°C; Part Number: ERJ-2GEJ6R8X; Value: 6.8 Ohms; ComponentLink1Description: Datasheet; ComponentLink1URL: https://b2b-api.panasonic.eu/file_stream/pids/fileversion/1242; ComponentLink2Description: DigiKey Link; ComponentLink2URL: http://digikey.com/product-detail/en/panasonic-electronic-components/ERJ-2GEJ6R8X/P6.8JCT-ND/282384; Composition: Thick Film; Device Package: 0402 (1005 Metric); Features: Automotive AEC-Q200; Height - Seated (Max): 0.016" (0.40mm); LastUpdated: 2/9/2020 1:08:02 AM; Lifecycle Status: Active; Minimum Order: 1; Number of Terminations: 2; Operating Temperature: -55°C ~ 155°C; Package / Case: 0402 (1005 Metric); Packaging: CutTape; PartId: 6342; Part Status: Active; Price: 0.10; Ratings: AEC-Q200; Resistance: 6.8 Ohms; Series: ERJ; Size / Dimension: 0.039" L x 0.020" W (1.00mm x 0.50mm); Supplier 1: DigiKey; Supplier Part Number 1: P6.8JCT-ND; Supplier Device Package: 0402; Tolerance: ±5%
R13 R20 = CPF0402B2K2E1: RES SMD 2.2K OHM 0.1% 1/16W 0402; Manufacturer: TE Connectivity Passive Product; Power (Watts): 0.063W, 1/16W; Temperature Coefficient: ±25ppm/°C; Part Number: CPF0402B2K2E1; Value: 2.2 kOhms; ComponentLink1Description: Datasheet; ComponentLink1URL: https://www.te.com/commerce/DocumentDelivery/DDEController?Action=srchrtrv&DocNm=1773200&DocType=DS&DocLang=English; ComponentLink2Description: DigiKey Link; ComponentLink2URL: http://digikey.com/product-detail/en/te-connectivity-passive-product/CPF0402B2K2E1/A102766CT-ND/2729299; Composition: Thin Film; Device Package: 0402 (1005 Metric); Height - Seated (Max): 0.014" (0.35mm); LastUpdated: 2/9/2020 1:08:09 AM; Lifecycle Status: Active; Minimum Order: 1; Number of Terminations: 2; Operating Temperature: -55°C ~ 155°C; Package / Case: 0402 (1005 Metric); Packaging: TapeAndReel; PartId: 3342; Part Status: Active; Price: 0.14; Resistance: 2.2 kOhms; Series: CPF, Neohm; Size / Dimension: 0.039" L x 0.020" W (1.00mm x 0.50mm); Supplier 1: DigiKey; Supplier Part Number 1: A102766CT-ND; Supplier Device Package: 0402; Tolerance: ±0.1%
R16 R19 = CRCW04024K70JNEDC: as R1 on sheet Microcontroller; Part Number: CRCW04024K70JNEDC; Value: 4.7 kOhms; ComponentLink1Description: Datasheet; ComponentLink1URL: http://www.vishay.com/docs/28773/crcwce3.pdf; ComponentLink2Description: DigiKey Link; ComponentLink2URL: http://digikey.com/product-detail/en/vishay-dale/CRCW04024K70JNEDC/541-3974-1-ND/7928657; Composition: Thick Film; Device Package: 0402 (1005 Metric); Height - Seated (Max): 0.014" (0.35mm); LastUpdated: 2/9/2020 1:07:41 AM; Lifecycle Status: Active; Minimum Order: 1; Number of Terminations: 2; Operating Temperature: -55°C ~ 155°C; Package / Case: 0402 (1005 Metric); Packaging: CutTape; PartId: 15960; Part Status: Active; Price: 0.10; Resistance: 4.7 kOhms; Series: CRCW-C; Size / Dimension: 0.039" L x 0.020" W (1.00mm x 0.50mm); Supplier 1: DigiKey; Supplier Part Number 1: 541-3974-1-ND; Supplier Device Package: 0402; Tolerance: ±5%

## Sheet SensorSuite.SchDoc
size A4; SheetNumber: 3; SheetTotal: 5
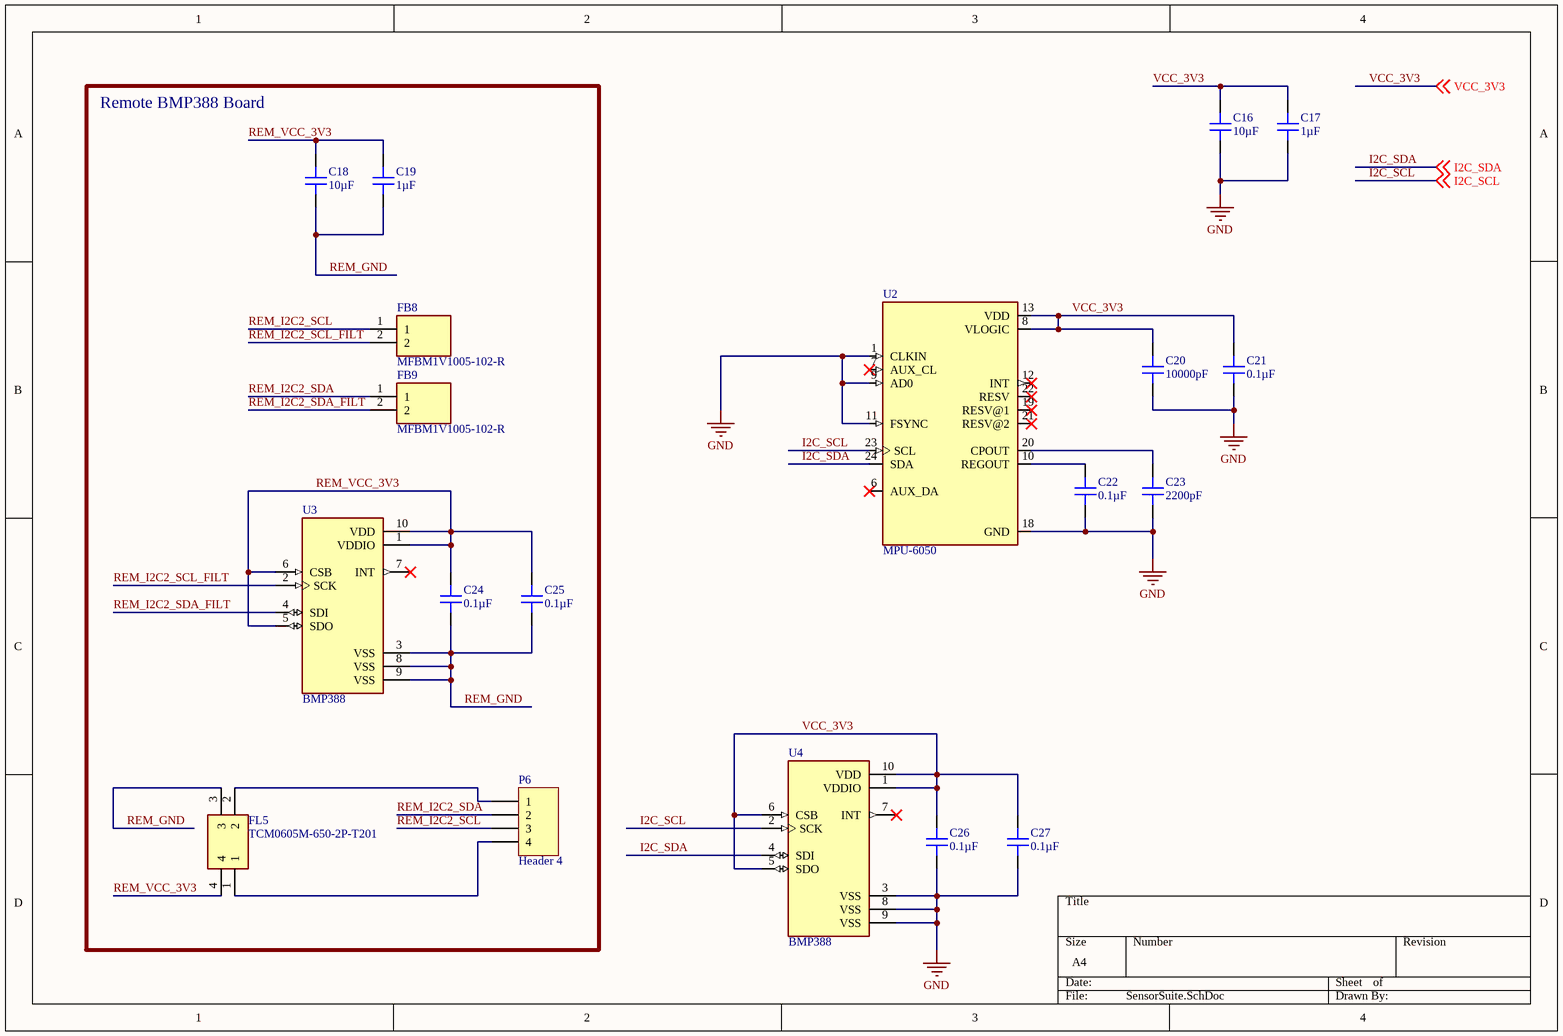
[diagram p2: SensorSuite.SchDoc]

### Parts
C16  10µF  [CAP 0402_1005]
C17  1µF  [CAP 0402_1005]
C18  10µF  [CAP 0402_1005]
C19  1µF  [CAP 0402_1005]
C20  10000pF  [CAP 0402_1005]
C21  0.1µF  [CAP 0402_1005]
C22  0.1µF  [CAP 0402_1005]
C23  2200pF  [CAP 0402_1005]
C24  0.1µF  [CAP 0402_1005]
C25  0.1µF  [CAP 0402_1005]
C26  0.1µF  [CAP 0402_1005]
C27  0.1µF  [CAP 0402_1005]
FB8  MFBM1V1005-102-R  [BEADC1005X65N]
FB9  MFBM1V1005-102-R  [BEADC1005X65N]
FL5  TCM0605M-650-2P-T201  [TCM0605M]
P6  Header 4  [HDR1X4]
U2  MPU-6050  [QFN50P400X400X95-24N]
U3  BMP388  [PQFN50P200X200X80-10N]
U4  BMP388  [PQFN50P200X200X80-10N]

### Blocks framed on the sheet
Remote BMP388 Board: C18 C19 C24 C25 FB8 FB9 FL5 P6 U3

### Nets
GND: C16.1 C17.1 C20.1 C21.1 C22.1 C23.1 C26.1 C27.1 U2.1(CLKIN) U2.9(AD0) U2.11(FSYNC) U2.18(GND) U4.3(VSS) U4.8(VSS) U4.9(VSS)
I2C_SCL: U2.23(SCL) U4.2(SCK) ; off-sheet I2C_SCL
I2C_SDA: U2.24(SDA) U4.4(SDI) ; off-sheet I2C_SDA
REM_GND: C18.1 C19.1 C24.1 C25.1 FL5.3 U3.3(VSS) U3.8(VSS) U3.9(VSS)
REM_I2C2_SCL: FB8.1 P6.3
REM_I2C2_SCL_FILT: FB8.2 U3.2(SCK)
REM_I2C2_SDA: FB9.1 P6.2
REM_I2C2_SDA_FILT: FB9.2 U3.4(SDI)
REM_VCC_3V3: C18.2 C19.2 C24.2 C25.2 FL5.4 U3.1(VDDIO) U3.5(SDO) U3.6(CSB) U3.10(VDD)
VCC_3V3: C16.2 C17.2 C20.2 C21.2 C26.2 C27.2 U2.8(VLOGIC) U2.13(VDD) U4.1(VDDIO) U4.5(SDO) U4.6(CSB) U4.10(VDD) ; off-sheet VCC_3V3
NetC22_2: C22.2 U2.10(REGOUT)
NetC23_2: C23.2 U2.20(CPOUT)
NetFL5_1: FL5.1 P6.4
NetFL5_2: FL5.2 P6.1

Not connected (* = marked no-connect by the designer): U2 6(AUX_DA)* 7(AUX_CL)* 12(INT)* 19(RESV@1)* 21(RESV@2)* 22(RESV)*; U3 7(INT)*; U4 7(INT)*

### Library data of the parts
C16 C18 = C0402C106M9PAC7867: as C1 on sheet Microcontroller; Part Number: C0402C106M9PAC7867; Value: 10µF; Applications: General Purpose; Capacitance: 10µF; ComponentLink1Description: Datasheet; ComponentLink1URL: https://api.kemet.com/component-edge/download/datasheet/C0402C106M9PAC7867.pdf; ComponentLink2Description: DigiKey Link; ComponentLink2URL: http://digikey.com/product-detail/en/kemet/C0402C106M9PAC7867/399-13069-1-ND/5767556; Device Package: 0402 (1005 Metric); LastUpdated: 2/9/2020 1:02:21 AM; Lifecycle Status: Active; Minimum Order: 1; Mounting Type: Surface Mount, MLCC; Operating Temperature: -55°C ~ 85°C; Package / Case: 0402 (1005 Metric); Packaging: TapeAndReel; PartId: 3087; Part Status: Active; Price: 0.13; Series: SMD Comm X5R; Size / Dimension: 0.039" L x 0.020" W (1.00mm x 0.50mm); Supplier 1: DigiKey; Supplier Part Number 1: 399-13069-1-ND; Temperature Coefficient: X5R; Thickness (Max): 0.028" (0.70mm); Voltage - Rated: 6.3V
C17 C19 = 0402YD105KAT2A: as C2 on sheet Microcontroller; Part Number: 0402YD105KAT2A; Value: 1µF; Applications: General Purpose; Capacitance: 1µF; ComponentLink1Description: Datasheet; ComponentLink1URL: http://datasheets.avx.com/cx5r.pdf; ComponentLink2Description: DigiKey Link; ComponentLink2URL: http://digikey.com/product-detail/en/avx-corporation/0402YD105KAT2A/478-10179-1-ND/6797606; Device Package: 0402 (1005 Metric); LastUpdated: 2/9/2020 1:02:22 AM; Lifecycle Status: Active; Minimum Order: 1; Mounting Type: Surface Mount, MLCC; Operating Temperature: -55°C ~ 85°C; Package / Case: 0402 (1005 Metric); Packaging: TapeAndReel; PartId: 2859; Part Status: Active; Price: 0.07; Series: -; Size / Dimension: 0.039" L x 0.020" W (1.00mm x 0.50mm); Supplier 1: DigiKey; Supplier Part Number 1: 478-10179-1-ND; Temperature Coefficient: X5R; Thickness (Max): 0.022" (0.55mm); Voltage - Rated: 16V
C20 = 0402B103K500CT: CAP CER 10000PF 50V X7R 0402; Manufacturer: Walsin Technology Corporation; Tolerance: ±10%; Part Number: 0402B103K500CT; Value: 10000pF; Applications: General Purpose; Capacitance: 10000pF; ComponentLink1Description: Datasheet; ComponentLink1URL: http://www.passivecomponent.com/wp-content/uploads/2018/10/MLCC.pdf; ComponentLink2Description: DigiKey Link; ComponentLink2URL: http://digikey.com/product-detail/en/walsin-technology-corporation/0402B103K500CT/1292-1628-1-ND/9355632; Device Package: 0402 (1005 Metric); LastUpdated: 2/9/2020 1:02:02 AM; Lifecycle Status: Active; Minimum Order: 1; Mounting Type: Surface Mount, MLCC; Operating Temperature: -55°C ~ 125°C; Package / Case: 0402 (1005 Metric); Packaging: CutTape; PartId: 11631; Part Status: Active; Price: 0.10; Series: -; Size / Dimension: 0.039" L x 0.020" W (1.00mm x 0.50mm); Supplier 1: DigiKey; Supplier Part Number 1: 1292-1628-1-ND; Temperature Coefficient: X7R; Thickness (Max): 0.022" (0.55mm); Voltage - Rated: 50V
C21 C22 C24-C27 = C0402C104K9PACTU: as C4 on sheet Microcontroller; Part Number: C0402C104K9PACTU; Value: 0.1µF; Applications: General Purpose; Capacitance: 0.1µF; ComponentLink1Description: Datasheet; ComponentLink1URL: https://api.kemet.com/component-edge/download/datasheet/C0402C104K9PACTU.pdf; ComponentLink2Description: DigiKey Link; ComponentLink2URL: http://digikey.com/product-detail/en/kemet/C0402C104K9PACTU/399-3026-1-ND/447602; Device Package: 0402 (1005 Metric); LastUpdated: 2/9/2020 1:01:34 AM; Lifecycle Status: Active; Minimum Order: 1; Mounting Type: Surface Mount, MLCC; Operating Temperature: -55°C ~ 85°C; Package / Case: 0402 (1005 Metric); Packaging: TapeAndReel; PartId: 12742; Part Status: Active; Price: 0.01; Series: SMD Comm X5R; Size / Dimension: 0.039" L x 0.020" W (1.00mm x 0.50mm); Supplier 1: DigiKey; Supplier Part Number 1: 399-3026-1-ND; Temperature Coefficient: X5R; Thickness (Max): 0.022" (0.55mm); Voltage - Rated: 6.3V
C23 = 0402B222K500CT: CAP CER 2200PF 50V X7R 0402; Manufacturer: Walsin Technology Corporation; Tolerance: ±10%; Part Number: 0402B222K500CT; Value: 2200pF; Applications: General Purpose; Capacitance: 2200pF; ComponentLink1Description: Datasheet; ComponentLink1URL: http://www.passivecomponent.com/wp-content/uploads/2018/10/MLCC.pdf; ComponentLink2Description: DigiKey Link; ComponentLink2URL: http://digikey.com/product-detail/en/walsin-technology-corporation/0402B222K500CT/1292-1193-1-ND/9355197; Device Package: 0402 (1005 Metric); LastUpdated: 2/9/2020 1:02:01 AM; Lifecycle Status: Active; Minimum Order: 1; Mounting Type: Surface Mount, MLCC; Operating Temperature: -55°C ~ 125°C; Package / Case: 0402 (1005 Metric); Packaging: TapeAndReel; PartId: 11799; Part Status: Active; Price: 0.01; Series: -; Size / Dimension: 0.039" L x 0.020" W (1.00mm x 0.50mm); Supplier 1: DigiKey; Supplier Part Number 1: 1292-1193-1-ND; Temperature Coefficient: X7R; Thickness (Max): 0.022" (0.55mm); Voltage - Rated: 50V
FB8 FB9 = MFBM1V1005-102-R: as FB1 on sheet Microcontroller; Datasheet Link: https://www.mouser.in/datasheet/2/87/eaton_mfbm1v1005_high_current_multilayer_ferrite_c-1890673.pdf; Height: 0.65mm
FL5 = TCM0605M-650-2P-T201: as FL1 on sheet Microcontroller; Datasheet Link: https://product.tdk.com/system/files/dam/doc/product/emc/emc/cmf_cmc/catalog/cmf_commercial_signal_tcm0605m_en.pdf; Height: 0.35mm; Manufacturer_Part_Number: TCM0605M-650-2P-T201
P6 = Header 4: Header, 4-Pin; LatestRevisionDate: 17-Jul-2002; LatestRevisionNote: Re-released for DXP Platform.; Publisher: Altium Limited
U2 = MPU-6050: Accelerometer, Gyroscope, 6 Axis Sensor IÂ²C Output; MF: TDK InvenSense; Price: None; Package: VFQFN-24 TDK InvenSense; MP: MPU-6050; Value: *; Availability: Unavailable; SnapEDA_Link: https://www.snapeda.com/parts/MPU-6050/TDK%20InvenSense/view-part/4503180/?ref=snap
U3 U4 = BMP388: Pressure Sensor 4.35PSI ~ 18.13PSI _30kPa ~ 125kPa_ Absolute 10-WFLGA; MF: Bosch Sensortec; MP: BMP388; Value: *; SnapEDA_Link: https://www.snapeda.com/parts/BMP388/Bosch%20Sensortec/view-part/2747857/?ref=snap; Package: WFLGA-10 Bosch Tools; Digi-Key_Part_Number: 828-1079-1-ND; Digi-Key_Purchase_URL: https://www.digikey.com/product-detail/en/bosch-sensortec/BMP388/828-1079-1-ND/8322640?utm_source=snapeda&utm_medium=aggregator&utm_campaign=symbol

## Sheet Radio.SchDoc
size A4; SheetNumber: 4; SheetTotal: 5
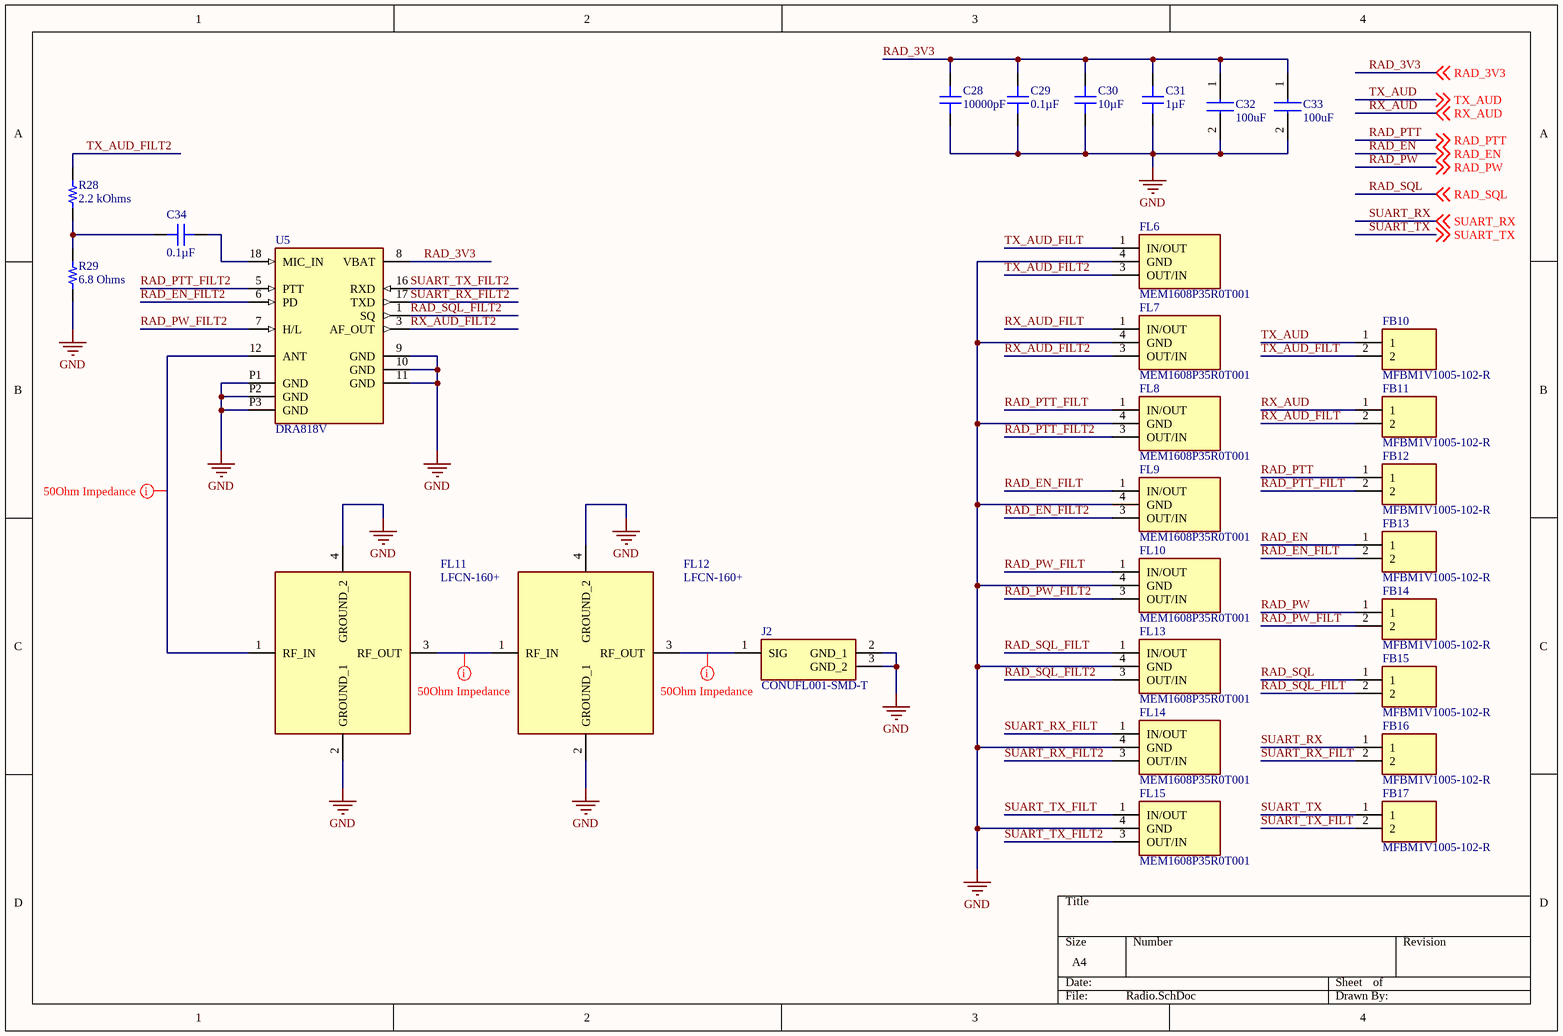
[diagram p3: Radio.SchDoc]

### Parts
C28  10000pF  [CAP 0402_1005]
C29  0.1µF  [CAP 0402_1005]
C30  10µF  [CAP 0402_1005]
C31  1µF  [CAP 0402_1005]
C32  100uF  [CAPC3225X270N]
C33  100uF  [CAPC3225X270N]
C34  0.1µF  [CAP 0402_1005]
FB10  MFBM1V1005-102-R  [BEADC1005X65N]
FB11  MFBM1V1005-102-R  [BEADC1005X65N]
FB12  MFBM1V1005-102-R  [BEADC1005X65N]
FB13  MFBM1V1005-102-R  [BEADC1005X65N]
FB14  MFBM1V1005-102-R  [BEADC1005X65N]
FB15  MFBM1V1005-102-R  [BEADC1005X65N]
FB16  MFBM1V1005-102-R  [BEADC1005X65N]
FB17  MFBM1V1005-102-R  [BEADC1005X65N]
FL6  MEM1608P35R0T001  [MEM1608P35R0T001]
FL7  MEM1608P35R0T001  [MEM1608P35R0T001]
FL8  MEM1608P35R0T001  [MEM1608P35R0T001]
FL9  MEM1608P35R0T001  [MEM1608P35R0T001]
FL10  MEM1608P35R0T001  [MEM1608P35R0T001]
FL11  LFCN-160+  [LFCN160]
FL12  LFCN-160+  [LFCN160]
FL13  MEM1608P35R0T001  [MEM1608P35R0T001]
FL14  MEM1608P35R0T001  [MEM1608P35R0T001]
FL15  MEM1608P35R0T001  [MEM1608P35R0T001]
J2  CONUFL001-SMD-T  [CONUFL001-SMD]
R28  2.2 kOhms  [RES 0402_1005]
R29  6.8 Ohms  [RES 0402_1005]
U5  DRA818V  [DORJI_DRA818V]

### Nets
GND: C28.1 C29.1 C30.1 C31.1 C32.2 C33.2 FL6.4(GND) FL7.4(GND) FL8.4(GND) FL9.4(GND) FL10.4(GND) FL11.2(GROUND_1) FL11.4(GROUND_2) FL12.2(GROUND_1) FL12.4(GROUND_2) FL13.4(GND) FL14.4(GND) FL15.4(GND) J2.2(GND_1) J2.3(GND_2) R29.1 U5.9(GND) U5.10(GND) U5.11(GND) U5.P1(GND) U5.P2(GND) U5.P3(GND)
RAD_3V3: C28.2 C29.2 C30.2 C31.2 C32.1 C33.1 U5.8(VBAT) ; off-sheet RAD_3V3
RAD_EN: FB13.1 ; off-sheet RAD_EN
RAD_EN_FILT: FB13.2 FL9.1(IN/OUT)
RAD_EN_FILT2: FL9.3(OUT/IN) U5.6(PD)
RAD_PTT: FB12.1 ; off-sheet RAD_PTT
RAD_PTT_FILT: FB12.2 FL8.1(IN/OUT)
RAD_PTT_FILT2: FL8.3(OUT/IN) U5.5(PTT)
RAD_PW: FB14.1 ; off-sheet RAD_PW
RAD_PW_FILT: FB14.2 FL10.1(IN/OUT)
RAD_PW_FILT2: FL10.3(OUT/IN) U5.7(H/L)
RAD_SQL: FB15.1 ; off-sheet RAD_SQL
RAD_SQL_FILT: FB15.2 FL13.1(IN/OUT)
RAD_SQL_FILT2: FL13.3(OUT/IN) U5.1(SQ)
RX_AUD: FB11.1 ; off-sheet RX_AUD
RX_AUD_FILT: FB11.2 FL7.1(IN/OUT)
RX_AUD_FILT2: FL7.3(OUT/IN) U5.3(AF_OUT)
SUART_RX: FB16.1 ; off-sheet SUART_RX
SUART_RX_FILT: FB16.2 FL14.1(IN/OUT)
SUART_RX_FILT2: FL14.3(OUT/IN) U5.17(TXD)
SUART_TX: FB17.1 ; off-sheet SUART_TX
SUART_TX_FILT: FB17.2 FL15.1(IN/OUT)
SUART_TX_FILT2: FL15.3(OUT/IN) U5.16(RXD)
TX_AUD: FB10.1 ; off-sheet TX_AUD
TX_AUD_FILT: FB10.2 FL6.1(IN/OUT)
TX_AUD_FILT2: FL6.3(OUT/IN) R28.1
NetC34_1: C34.1 U5.18(MIC_IN)
NetC34_2: C34.2 R28.2 R29.2
NetFL11_1: FL11.1(RF_IN) U5.12(ANT)
NetFL11_3: FL11.3(RF_OUT) FL12.1(RF_IN)
NetFL12_3: FL12.3(RF_OUT) J2.1(SIG)

### Layout directives
net class Z50Ohm: NetFL11_1, NetFL11_3, NetFL12_3

### Library data of the parts
C28 = 0402B103K500CT: as C20 on sheet SensorSuite; Part Number: 0402B103K500CT; Value: 10000pF; Applications: General Purpose; Capacitance: 10000pF; ComponentLink1Description: Datasheet; ComponentLink1URL: http://www.passivecomponent.com/wp-content/uploads/2018/10/MLCC.pdf; ComponentLink2Description: DigiKey Link; ComponentLink2URL: http://digikey.com/product-detail/en/walsin-technology-corporation/0402B103K500CT/1292-1628-1-ND/9355632; Device Package: 0402 (1005 Metric); LastUpdated: 2/9/2020 1:02:02 AM; Lifecycle Status: Active; Minimum Order: 1; Mounting Type: Surface Mount, MLCC; Operating Temperature: -55°C ~ 125°C; Package / Case: 0402 (1005 Metric); Packaging: CutTape; PartId: 11631; Part Status: Active; Price: 0.10; Series: -; Size / Dimension: 0.039" L x 0.020" W (1.00mm x 0.50mm); Supplier 1: DigiKey; Supplier Part Number 1: 1292-1628-1-ND; Temperature Coefficient: X7R; Thickness (Max): 0.022" (0.55mm); Voltage - Rated: 50V
C29 C34 = C0402C104K9PACTU: as C4 on sheet Microcontroller; Part Number: C0402C104K9PACTU; Value: 0.1µF; Applications: General Purpose; Capacitance: 0.1µF; ComponentLink1Description: Datasheet; ComponentLink1URL: https://api.kemet.com/component-edge/download/datasheet/C0402C104K9PACTU.pdf; ComponentLink2Description: DigiKey Link; ComponentLink2URL: http://digikey.com/product-detail/en/kemet/C0402C104K9PACTU/399-3026-1-ND/447602; Device Package: 0402 (1005 Metric); LastUpdated: 2/9/2020 1:01:34 AM; Lifecycle Status: Active; Minimum Order: 1; Mounting Type: Surface Mount, MLCC; Operating Temperature: -55°C ~ 85°C; Package / Case: 0402 (1005 Metric); Packaging: TapeAndReel; PartId: 12742; Part Status: Active; Price: 0.01; Series: SMD Comm X5R; Size / Dimension: 0.039" L x 0.020" W (1.00mm x 0.50mm); Supplier 1: DigiKey; Supplier Part Number 1: 399-3026-1-ND; Temperature Coefficient: X5R; Thickness (Max): 0.022" (0.55mm); Voltage - Rated: 6.3V
C30 = C0402C106M9PAC7867: as C1 on sheet Microcontroller; Part Number: C0402C106M9PAC7867; Value: 10µF; Applications: General Purpose; Capacitance: 10µF; ComponentLink1Description: Datasheet; ComponentLink1URL: https://api.kemet.com/component-edge/download/datasheet/C0402C106M9PAC7867.pdf; ComponentLink2Description: DigiKey Link; ComponentLink2URL: http://digikey.com/product-detail/en/kemet/C0402C106M9PAC7867/399-13069-1-ND/5767556; Device Package: 0402 (1005 Metric); LastUpdated: 2/9/2020 1:02:21 AM; Lifecycle Status: Active; Minimum Order: 1; Mounting Type: Surface Mount, MLCC; Operating Temperature: -55°C ~ 85°C; Package / Case: 0402 (1005 Metric); Packaging: TapeAndReel; PartId: 3087; Part Status: Active; Price: 0.13; Series: SMD Comm X5R; Size / Dimension: 0.039" L x 0.020" W (1.00mm x 0.50mm); Supplier 1: DigiKey; Supplier Part Number 1: 399-13069-1-ND; Temperature Coefficient: X5R; Thickness (Max): 0.028" (0.70mm); Voltage - Rated: 6.3V
C31 = 0402YD105KAT2A: as C2 on sheet Microcontroller; Part Number: 0402YD105KAT2A; Value: 1µF; Applications: General Purpose; Capacitance: 1µF; ComponentLink1Description: Datasheet; ComponentLink1URL: http://datasheets.avx.com/cx5r.pdf; ComponentLink2Description: DigiKey Link; ComponentLink2URL: http://digikey.com/product-detail/en/avx-corporation/0402YD105KAT2A/478-10179-1-ND/6797606; Device Package: 0402 (1005 Metric); LastUpdated: 2/9/2020 1:02:22 AM; Lifecycle Status: Active; Minimum Order: 1; Mounting Type: Surface Mount, MLCC; Operating Temperature: -55°C ~ 85°C; Package / Case: 0402 (1005 Metric); Packaging: TapeAndReel; PartId: 2859; Part Status: Active; Price: 0.07; Series: -; Size / Dimension: 0.039" L x 0.020" W (1.00mm x 0.50mm); Supplier 1: DigiKey; Supplier Part Number 1: 478-10179-1-ND; Temperature Coefficient: X5R; Thickness (Max): 0.022" (0.55mm); Voltage - Rated: 16V
C32 C33 = GRM32EC70J107ME15L: as C3 on sheet Microcontroller; Datasheet Link: https://componentsearchengine.com//GRM32EC70J107ME15L.pdf; Height: 2.7mm; Mouser2 Part Number: 81-GRM32EC70J107ME5L; Mouser2 Price/Stock: https://www.mouser.com/Search/Refine.aspx?Keyword=81-GRM32EC70J107ME5L; Manufacturer_Part_Number: GRM32EC70J107ME15L
FB10-FB17 = MFBM1V1005-102-R: as FB1 on sheet Microcontroller; Datasheet Link: https://www.mouser.in/datasheet/2/87/eaton_mfbm1v1005_high_current_multilayer_ferrite_c-1890673.pdf; Height: 0.65mm
FL6-FL10 FL13-FL15 = MEM1608P35R0T001: Filter; Manufacturer_Name: TDK; Datasheet Link: https://product.tdk.com/system/files/dam/doc/product/emc/emc/3tf/catalog/3tf_commercial_signal_mem1608p_en.pdf; Height: 0.7mm; Manufacturer_Part_Number: MEM1608P35R0T001
FL11 FL12 = LFCN-160+: Filter; Manufacturer_Name: Mini-Circuits; Datasheet Link: https://www.minicircuits.com/pdfs/LFCN-160+.pdf; Height: 0.94mm; Manufacturer_Part_Number: LFCN-160+
J2 = CONUFL001-SMD-T: Connector; Manufacturer_Name: Linx Technologies; Datasheet Link: https://componentsearchengine.com//CONUFL001-SMD-T.pdf; Mouser2 Part Number: 712-CONUFL001-SMD-T; Mouser2 Price/Stock: https://www.mouser.com/Search/Refine.aspx?Keyword=712-CONUFL001-SMD-T; Manufacturer_Part_Number: CONUFL001-SMD-T
R28 = CPF0402B2K2E1: as R13 on sheet Power; Part Number: CPF0402B2K2E1; Value: 2.2 kOhms; ComponentLink1Description: Datasheet; ComponentLink1URL: https://www.te.com/commerce/DocumentDelivery/DDEController?Action=srchrtrv&DocNm=1773200&DocType=DS&DocLang=English; ComponentLink2Description: DigiKey Link; ComponentLink2URL: http://digikey.com/product-detail/en/te-connectivity-passive-product/CPF0402B2K2E1/A102766CT-ND/2729299; Composition: Thin Film; Device Package: 0402 (1005 Metric); Height - Seated (Max): 0.014" (0.35mm); LastUpdated: 2/9/2020 1:08:09 AM; Lifecycle Status: Active; Minimum Order: 1; Number of Terminations: 2; Operating Temperature: -55°C ~ 155°C; Package / Case: 0402 (1005 Metric); Packaging: TapeAndReel; PartId: 3342; Part Status: Active; Price: 0.14; Resistance: 2.2 kOhms; Series: CPF, Neohm; Size / Dimension: 0.039" L x 0.020" W (1.00mm x 0.50mm); Supplier 1: DigiKey; Supplier Part Number 1: A102766CT-ND; Supplier Device Package: 0402; Tolerance: ±0.1%
R29 = ERJ-2GEJ6R8X: as R9 on sheet Power; Part Number: ERJ-2GEJ6R8X; Value: 6.8 Ohms; ComponentLink1Description: Datasheet; ComponentLink1URL: https://b2b-api.panasonic.eu/file_stream/pids/fileversion/1242; ComponentLink2Description: DigiKey Link; ComponentLink2URL: http://digikey.com/product-detail/en/panasonic-electronic-components/ERJ-2GEJ6R8X/P6.8JCT-ND/282384; Composition: Thick Film; Device Package: 0402 (1005 Metric); Features: Automotive AEC-Q200; Height - Seated (Max): 0.016" (0.40mm); LastUpdated: 2/9/2020 1:08:02 AM; Lifecycle Status: Active; Minimum Order: 1; Number of Terminations: 2; Operating Temperature: -55°C ~ 155°C; Package / Case: 0402 (1005 Metric); Packaging: CutTape; PartId: 6342; Part Status: Active; Price: 0.10; Ratings: AEC-Q200; Resistance: 6.8 Ohms; Series: ERJ; Size / Dimension: 0.039" L x 0.020" W (1.00mm x 0.50mm); Supplier 1: DigiKey; Supplier Part Number 1: P6.8JCT-ND; Supplier Device Package: 0402; Tolerance: ±5%
U5 = DRA818V: VHF Band Voice Transceiver Module; MF: DORJI; Price: None; Check_prices: https://www.snapeda.com/parts/DRA818V/DORJI/view-part/2654524/?ref=eda; SnapEDA_Link: https://www.snapeda.com/parts/DRA818V/DORJI/view-part/2654524/?ref=snap; Package: Package; Availability: Unavailable; MP: DRA818V; Value: *